# EAGLE schematic GPSSDver2 (EAGLE 9.6.2)
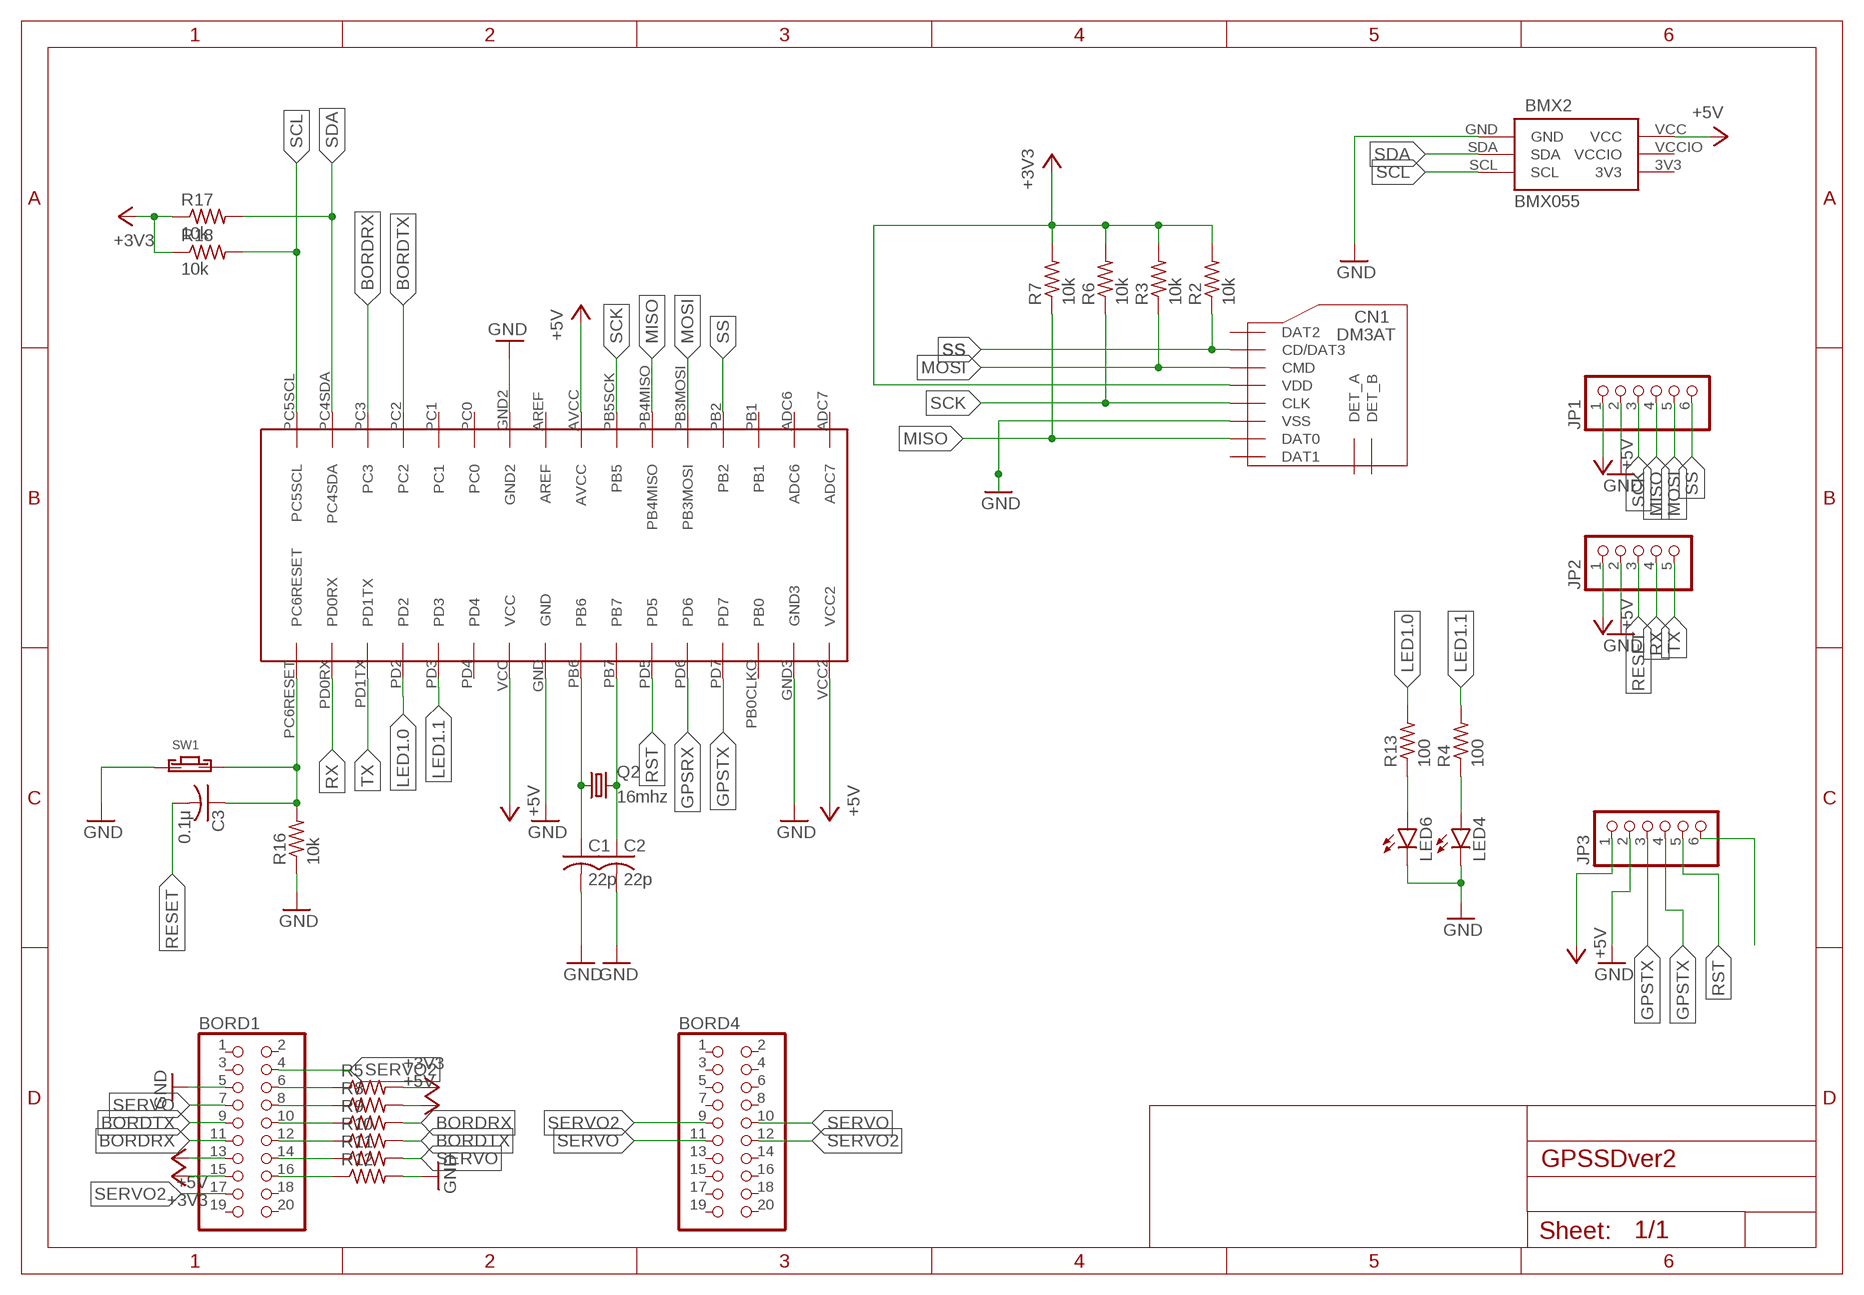
[diagram p0: schematic, sheet 1]

## Parts
BMX2  BMX055  [BMX055]
BORD1  PINHD-2X10/90  [2X10/90]
BORD4  PINHD-2X10/90  [2X10/90]
C1  22p  C-USC1608  [C1608]
C2  22p  C-USC1608  [C1608]
C3  0.1μ  C-USC1608  [C1608]
CN1  DM3AT  [DM3AT]
JP1  PINHD-1X6  [1X06]
JP2  PINHD-1X5  [1X05]
JP3  PINHD-1X6  [1X06]
LED4  LED5MM  [LED5MM]
LED6  LED5MM  [LED5MM]
Q2  16mhz  CRYSTALHC49UP  [HC49UP]
R2  10k  R-US_R0603  [R0603]
R3  10k  R-US_R0603  [R0603]
R4  100  R-US_R0603  [R0603]
R5  R-US_R0603  [R0603]
R6  10k  R-US_R0603  [R0603]
R7  10k  R-US_R0603  [R0603]
R8  R-US_R0603  [R0603]
R9  R-US_R0603  [R0603]
R10  R-US_R0603  [R0603]
R11  R-US_R0603  [R0603]
R12  R-US_R0603  [R0603]
R13  100  R-US_R0603  [R0603]
R16  10k  R-US_R0603  [R0603]
R17  10k  R-US_R0603  [R0603]
R18  10k  R-US_R0603  [R0603]
SW1  TVAF06-A020B-R  [TVAF06-A020B-R]
U$3  ATMEGA328P-AU  [ATMEGA328P-AU]

## Nets
+3V3: BORD1.15 CN1.VDD R2.2 R3.2 R5.2 R6.2 R7.2 R17.1 R18.1
+5V: BMX2.VCC BORD1.13 JP1.1 JP2.1 JP3.1 R8.2 U$3.AVCC U$3.VCC U$3.VCC2
BORDRX: BORD1.11 R9.2 U$3.PC3
BORDTX: BORD1.9 R10.2 U$3.PC2
GND: BMX2.GND BORD1.5 C1.2 C2.2 CN1.VSS JP1.2 JP2.2 JP3.2 LED4.K(C) LED6.K(C) R12.2 R16.1 SW1.P$1 U$3.GND U$3.GND2 U$3.GND3
GPSRX: U$3.PD6
GPSTX: JP3.3 JP3.4 U$3.PD7
LED1.0: R13.2 U$3.PD2
LED1.1: R4.2 U$3.PD3
MISO: CN1.DAT0 JP1.4 R7.1 U$3.PB4MISO
MOSI: CN1.CMD JP1.5 R3.1 U$3.PB3MOSI
N$1: LED6.A R13.1
N$2: BORD1.6 R5.1
N$3: BORD1.8 R8.1
N$4: BORD1.10 R9.1
N$5: JP3.6
N$8: BORD1.12 R10.1
N$9: BORD1.14 R11.1
N$10: BORD1.16 R12.1
N$11: LED4.A R4.1
N$12: C3.1 R16.2 SW1.P$2 U$3.PC6RESET
N$13: C1.1 Q2.1 U$3.PB6
N$14: C2.1 Q2.2 U$3.PB7
RESET: C3.2 JP2.3
RST: JP3.5 U$3.PD5
RX: JP2.4 U$3.PD0RX
SCK: CN1.CLK JP1.3 R6.1 U$3.PB5SCK(PB5)
SCL: BMX2.SCL R18.2 U$3.PC5SCL
SDA: BMX2.SDA R17.2 U$3.PC4SDA
SERVO: BORD1.7 BORD4.10 BORD4.11 R11.2
SERVO2: BORD1.4 BORD1.17 BORD4.9 BORD4.12
SS: CN1.CD/DAT3 JP1.6 R2.1 U$3.PB2
TX: JP2.5 U$3.PD1TX
Unconnected: BORD1.1 BORD1.2 BORD1.3 BORD1.18 BORD1.19 BORD1.20 BORD4.1 BORD4.2 BORD4.3 BORD4.4 BORD4.5 BORD4.6 BORD4.7 BORD4.8 BORD4.13 BORD4.14 BORD4.15 BORD4.16 BORD4.17 BORD4.18 BORD4.19 BORD4.20 CN1.DAT1 CN1.DAT2 CN1.DET_A CN1.DET_B U$3.ADC6 U$3.ADC7 U$3.AREF U$3.PB0CLKO(PB0) U$3.PB1 U$3.PC0 U$3.PC1 U$3.PD4

## Power pins joined to a net without a drawn wire
3V3: BMX2.3V3
VCCIO: BMX2.VCCIO

## Library data of the parts
BMX2 = BMX055:BMX055
BORD1 BORD4 = pinhead:PINHD-2X10: PIN HEADER
C1-C3 = rcl:C-US: CAPACITOR, American symbol; SPICEPREFIX: C
CN1 = microSD:DM3AT
JP1 JP3 = pinhead:PINHD-1X6: PIN HEADER
JP2 = pinhead:PINHD-1X5: PIN HEADER
LED4 LED6 = led:LED: LED OSRAM: - CHIPLED LG R971, LG N971, LY N971, LG Q971, LY Q971, LO R971, LY R971 LH N974, LH R974 LS Q976, LO Q976, LY Q976 LO Q996 - Hyper CHIPLED LW Q18S LB Q993, LB Q99A, LB R99A - SideLED LS A670, LO A670, LY A670, LG A670, LP A670 LB A673, LV A673, LT A673, LW A673 LH A674 LY A675 LS A676, LA A676, LO A676, LY A676, LW A676 LS A679, LY A679, LG A679 - Hyper Micro SIDELED® LS Y876, LA Y876, LO Y876, LY Y876 LT Y87S - SmartLED LW L88C, LW L88S LB L89C, LB L89S, LG L890 LS L89K, LO L89K, LY L89K LS L896, LA L896, LO L896, LY L896 - TOPLED LS T670, LO T670, LY T670, LG T670, LP T670 LSG T670, LSP T670, LSY T670, LOP T670, LYG T670 LG T671, LOG T671, LSG T671 LB T673, LV T673, LT T673, LW T673 LH T674 LS T676, LA T676, LO T676, LY T676, LB T676, LH T676, LSB T676, LW T676 LB T67C, LV T67C, LT T67C, LS T67K, LO T67K, LY T67K, LW E67C LS E67B, LA E67B, LO E67B, LY E67B, LB E67C, LV E67C, LT E67C LW T67C LS T679, LY T679, LG T679 LS T770, LO T770, LY T770, LG T770, LP T770 LB T773, LV T773, LT T773, LW T773 LH T774 LS E675, LA E675, LY E675, LS T675 LS T776, LA T776, LO T776, LY T776, LB T776 LHGB T686 LT T68C, LB T68C - Hyper Mini TOPLED® LB M676 - Mini TOPLED Santana® LG M470 LS M47K, LO M47K, LY M47K Source: http://www.osram.convergy.de LUXEON: - LUMILED® LXK2-PW12-R00, LXK2-PW12-S00, LXK2-PW14-U00, LXK2-PW14-V00 LXK2-PM12-R00, LXK2-PM12-S00, LXK2-PM14-U00 LXK2-PE12-Q00, LXK2-PE12-R00, LXK2-PE12-S00, LXK2-PE14-T00, LXK2-PE14-U00 LXK2-PB12-K00, LXK2-PB12-L00, LXK2-PB12-M00, LXK2-PB14-N00, LXK2-PB14-P00, LXK2-PB14-Q00 LXK2-PR12-L00, LXK2-PR12-M00, LXK2-PR14-Q00, LXK2-PR14-R00 LXK2-PD12-Q00, LXK2-PD12-R00, LXK2-PD12-S00 LXK2-PH12-R00, LXK2-PH12-S00 LXK2-PL12-P00, LXK2-PL12-Q00, LXK2-PL12-R00 Source: www.luxeon.com KINGBRIGHT: KA-3528ASYC Source: www.kingbright.com
Q2 = crystal:CRYSTAL: CRYSTAL; OC_FARNELL: unknown; OC_NEWARK: unknown
R2-R13 R16-R18 = rcl:R-US_: RESISTOR, American symbol; SPICEPREFIX: R
SW1 = Tact switch:TVAF06-A020B-R
U$3 = ATmega328p-PU:ATMEGA328P-AU

## Net classes
0 default: width 0.406 mm